# EAGLE schematic CircuitRiver - Breakout-LiPo Spring (EAGLE 7.5.0)
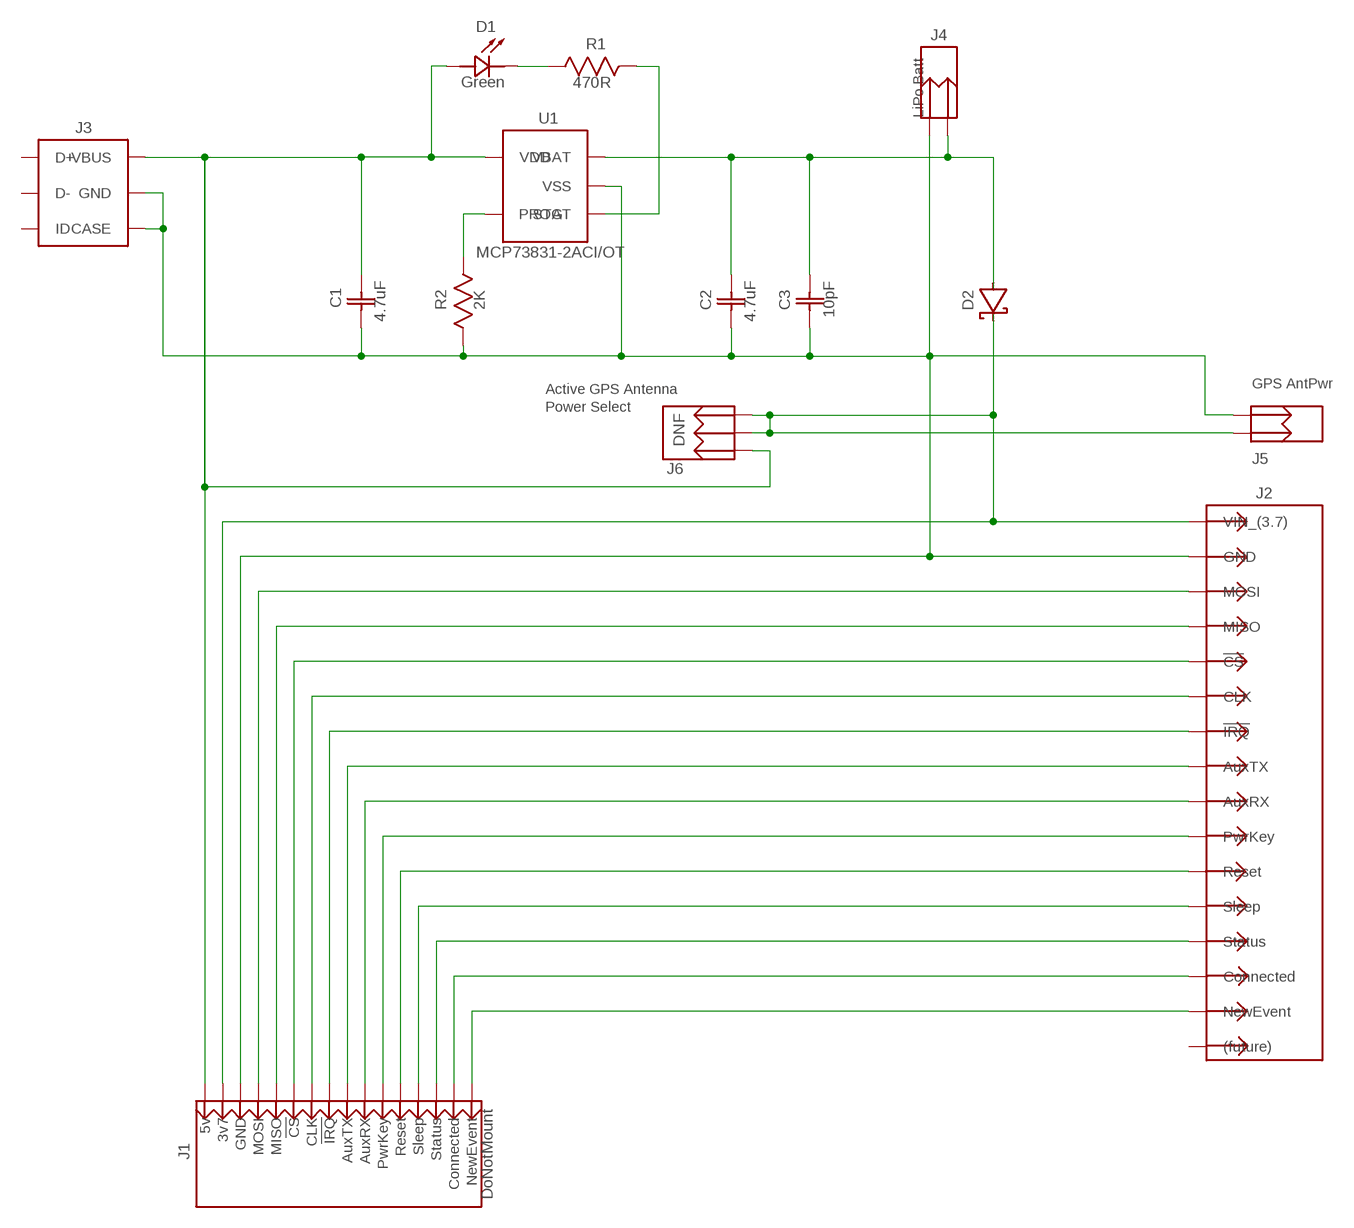
[diagram p0: schematic, sheet 1]

## Parts
C1  4.7uF  CAP_0603_NP  [CAP_0603]
C2  4.7uF  CAP_0603_NP  [CAP_0603]
C3  10pF  CAP_0603_NP  [CAP_0603]
D1  Green  LED-0603_SMD  [LED_0603]
D2  SCHOTTKY_RECT_-_2A60V  [SOD-123FL_Diode]
J1  DoNotMount  BREADBOARD-16  [HDR-1x16T/2.54]
J2  HA-CTA_HEADER  [HDR-2x8T/2x2/16x4]
J3  USB_JACK  [ZX62-B-5P]
J4  JST_PH-2_T/H  [JST_PH-2_T/H]
J5  JST_PH-2_T/H  [JST_PH-2_T/H]
J6  DNF  3PIN_T/H_HEADER  [HDR-1x3T/2/6x2]
LG1  LOOUQ_LOGO  [LooUQ-6mm]
LG2  CIRCUITRIVER_LOGO  [CircuitRiver-6mm]
R1  470R  RES_0603  [RES_0603]
R2  2K  RES_0603  [RES_0603]
U1  MCP73831-2ACI/OT  [SOT23-5]

## Nets
Net_0: C1.1 D1.2(A) J1.1(5v) J3.1(VBUS) J6.3 U1.4(VDD)
Net_1: D2.1(C) J1.2(3v7) J2.2(VIN_(3.7)) J5.1 J6.1 J6.2
Net_3: J1.16(NewEvent) J2.16(NewEvent)
Net_4: J1.15(Connected) J2.13(Connected)
Net_5: J1.14(Status) J2.14(Status)
Net_6: J1.13(Sleep) J2.11(Sleep)
Net_7: J1.12(Reset) J2.12(Reset)
Net_8: J1.11(PwrKey) J2.9(PwrKey)
Net_9: J1.10(AuxRX) J2.10(AuxRX)
Net_10: J1.9(AuxTX) J2.7(AuxTX)
Net_11: J1.8(!IRQ) J2.8(!IRQ)
Net_12: J1.7(CLK) J2.5(CLK)
Net_13: J1.6(!CS) J2.6(!CS)
Net_14: J1.5(MISO) J2.3(MISO)
Net_15: J1.4(MOSI) J2.4(MOSI)
Net_16: C2.1 C3.2 D2.2(A) J4.1 U1.3(VBAT)
Net_17: R1.2 U1.1(STAT)
Net_20: R2.2 U1.5(PROG)
Net_22: D1.1(C) R1.1
Net_GND: C1.2 C2.2 C3.1 J1.3(GND) J2.1(GND) J3.5(GND) J3.6(CASE) J3.8(CASE) J4.2 J5.2 R2.1 U1.2(VSS)
Unconnected: J2.15((future)) J3.2(D-) J3.3(D+) J3.4(ID)

## Notes on the sheet
- LiPo Batt
- GPS AntPwr
- Active GPS Antenna
- Power Select

## Library data of the parts
C1 C2 = common:CAP_0603_NP; MANUFACTURER: Samsung; MFGPARTNM: CL10A475KQ8NNNC
C3 = common:CAP_0603_NP; MANUFACTURER: Samsung; MFGPARTNM: CL10A475KQ8NNNC; VALUE: 4.7uF
D1 = common:LED-0603_SMD; MANUFACTURER: Lite-On; MFGPARTNM: LTST-C190GKT
D2 = common:SCHOTTKY_RECT_-_2A60V; DATASHEET: https://www.onsemi.com/pub/Collateral/NTS260ESF-D.PDF; DESCRIPTION: DIODE SCHOTTKY 60V 2A SOD123FL; MANUFACTURER: On Semiconductor; MFGPARTNM: NRVTS260ESFT1G
J1 = common:BREADBOARD-16; DATASHEET: http://datasheets.diptrace.com/con_headers/ENG_CD_644456_D2.pdf; MANUFACTURER: TE Connectivity
J2 = common:HA-CTA_HEADER; DATASHEET: https://cdn.harwin.com/pdfs/M22-204.pdf; MANUFACTURER: Harwin; MFGPARTNM: M22-2040805
J3 = common:USB_JACK; DATASHEET: http://datasheets.diptrace.com/con_usb/ZX62-B-5P.pdf; MANUFACTURER: Hirose; MFGPARTNM: ZX62-B-5PA(33)
J4 J5 = common:JST_PH-2_T/H; DATASHEET: https://media.digikey.com/pdf/Data%20Sheets/3M%20PDFs/951yyy-xx22-AR_Series%20Datasheet.pdf; MANUFACTURER: JST; MFGPARTNM: 951102-8622-AR
J6 = common:3PIN_T/H_HEADER; DATASHEET: https://media.digikey.com/pdf/Data%20Sheets/3M%20PDFs/951yyy-xx22-AR_Series%20Datasheet.pdf; MANUFACTURER: 3M; MFGPARTNM: 951103-8622-AR
LG1 = common:LOOUQ_LOGO
LG2 = common:CIRCUITRIVER_LOGO
R1 = common:RES_0603; MANUFACTURER: Yageo; MFGPARTNM: RC0603FR-07470RL
R2 = common:RES_0603; MANUFACTURER: Yageo; MFGPARTNM: RC0603FR-07470RL; VALUE: 470R
U1 = common:MCP73831-2ACI/OT; DESCRIPTION: IC CONTROLLR LI-ION 4.2V SOT23-5; MANUFACTURER: On Semiconductor; MFGPARTNM: MCP73831T-2ACI/OT